# Altium schematic sheet full.SchDoc
size A4; SheetNumber: 1; SheetTotal: 2; SPICEModelCacheFOHOLSYI: <root> / <DocumentId>FOHOLSYI</DocumentId> / <CacheFrame Number="0"> / <Model Name="1n4002" Kind="MDL"> / <Text>*1N4002 MCE 8-16-95 / *100V 1A Si GenPurpose Diode pkg:DIODE0.4 1,2 / .MODEL 1N4002 D(IS=2.55E-9 RS=0.042 N=1.75 TT=5.76E-6 CJO=1.85E-11 / + VJ=0.75 M=0.333 BV=100 IBV=1E-5 )</Text> / </Model> / </CacheFrame> / </root>
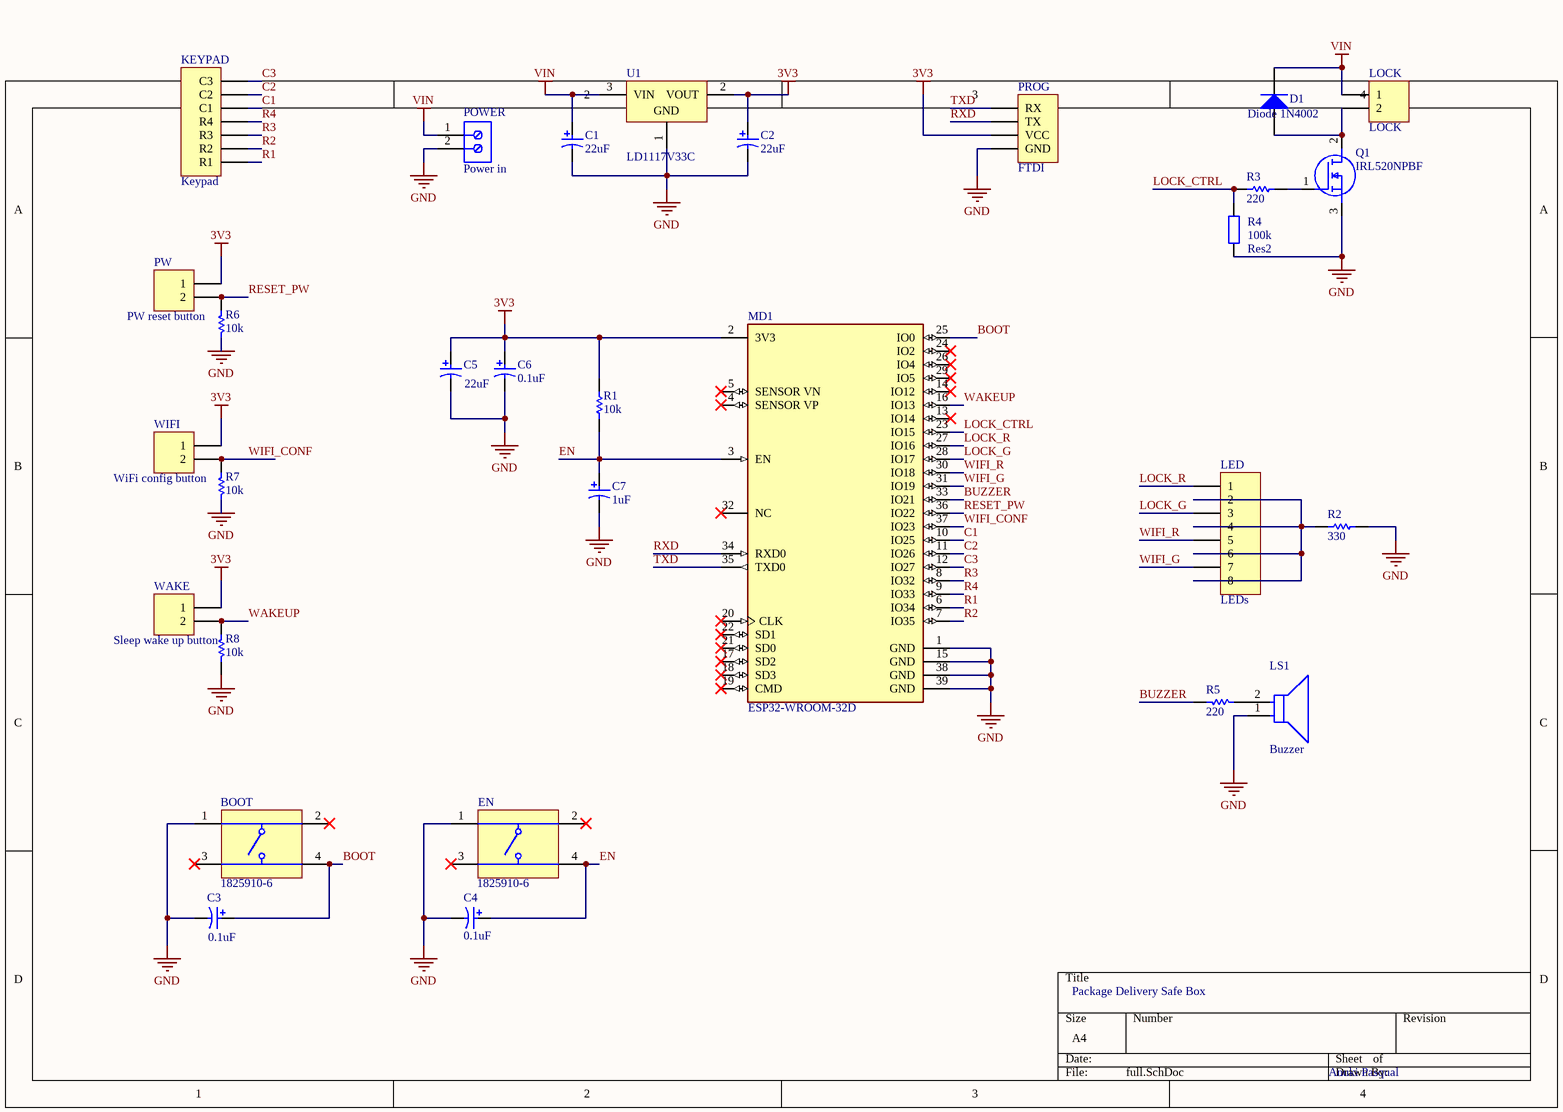
[diagram p0: full.SchDoc]

## Parts
BOOT  1825910-6  [TECO-1825910-6_V]
C1  22uF  [CAPPR55-200-1100X500X1200]
C2  22uF  [CAPPR55-200-1100X500X1200]
C3  0.1uF  [CAPPR55-200-1100X500X1200]
C4  0.1uF  [CAPPR55-200-1100X500X1200]
C5  22uF  [CAPPR55-200-1100X500X1200]
C6  0.1uF  [CAPPR55-200-1100X500X1200]
C7  1uF  [CAPPR55-200-1100X500X1200]
D1  Diode 1N4002  [DO-41]
EN  1825910-6  [TECO-1825910-6_V]
KEYPAD  Keypad  [HDR1X7]
LED  LEDs  [HDR1X8]
LOCK  LOCK  [HDR1X2]
LS1  Buzzer  [FP-MCKPX-G1203A-K4056-MFG]
MD1  ESP32-WROOM-32D  [FP-ESP32-WROOM-32D-MFG]
POWER  Power in  [691102710002]
PROG  FTDI  [HDR1X4]
PW  PW reset button  [HDR1X2]
Q1  IRL520NPBF  [TO254P469X1042X1967-3P]
R1  value 10k  [AXIAL-0.3]
R2  330  [AXIAL-0.3]
R3  value 220  [AXIAL-0.3]
R4  Res2  value 100k  [AXIAL-0.4]
R5  value 220  [AXIAL-0.3]
R6  value 10k  [AXIAL-0.3]
R7  value 10k  [AXIAL-0.3]
R8  value 10k  [AXIAL-0.3]
U1  LD1117V33C  [TO220]
WAKE  Sleep wake up button  [HDR1X2]
WIFI  WiFi config button  [HDR1X2]

## Nets
3V3: C2.1 C5.1 C6.1 MD1.2(3V3) PROG.3(VCC) PW.1 R1.2 U1.2(VOUT) WAKE.1 WIFI.1
GND: BOOT.1 C1.2 C2.2 C3.2 C4.2 C5.2 C6.2 C7.2 EN.1 LS1.1(C) MD1.1(GND) MD1.15(GND) MD1.38(GND) MD1.39(GND) POWER.2 PROG.4(GND) Q1.3(S) R2.2 R4.1 R6.2 R7.2 R8.2 U1.1(GND)
VIN: C1.1 D1.2(K) LOCK.1 POWER.1 U1.3(VIN)
BOOT: BOOT.4 C3.1 MD1.25(IO0)
BUZZER: MD1.33(IO21) R5.1
C1: KEYPAD.5(C1) MD1.10(IO25)
C2: KEYPAD.6(C2) MD1.11(IO26)
C3: KEYPAD.7(C3) MD1.12(IO27)
EN: C4.1 C7.1 EN.4 MD1.3(EN) R1.1
LOCK_CTRL: MD1.23(IO15) R3.2 R4.2
LOCK_G: LED.3 MD1.28(IO17)
LOCK_R: LED.1 MD1.27(IO16)
R1: KEYPAD.1(R1) MD1.6(IO34)
R2: KEYPAD.2(R2) MD1.7(IO35)
R3: KEYPAD.3(R3) MD1.8(IO32)
R4: KEYPAD.4(R4) MD1.9(IO33)
RESET_PW: MD1.36(IO22) PW.2 R6.1
RXD: MD1.34(RXD0) PROG.2(TX)
TXD: MD1.35(TXD0) PROG.1(RX)
WAKEUP: MD1.16(IO13) R8.1 WAKE.2
WIFI_CONF: MD1.37(IO23) R7.1 WIFI.2
WIFI_G: LED.7 MD1.31(IO19)
WIFI_R: LED.5 MD1.30(IO18)
NetD1_1: D1.1(A) LOCK.2 Q1.2(D)
NetLED_2: LED.2 LED.4 LED.6 LED.8 R2.1
NetLS1_2: LS1.2(A) R5.2
NetQ1_1: Q1.1(G) R3.1

Not connected (* = marked no-connect by the designer): BOOT 2* 3*; EN 2* 3*; MD1 4(SENSOR_VP)* 5(SENSOR_VN)* 13(IO14)* 14(IO12)* 17(SD2)* 18(SD3)* 19(CMD)* 20(CLK)* 21(SD0)* 22(SD1)* 24(IO2)* 26(IO4)* 29(IO5)* 32(NC)*

## Notes on the sheet
- Package Delivery Safe Box
- Anuki Pasqual

## Library data of the parts
BOOT EN = CMP-1684-00021-1: Tact Switch, SPST-NO, 0.05 A, -35 to 85 degC, 4-Pin THD, RoHS, Bulk; Manufacturer: TE Connectivity; Maximum Contact Resistance: 100mOhm; Mechanical Life: 100000Cycles; Bushing Type: Unthreaded; Switch Configuration: OFF(ON); Maximum DC Voltage Rating: 24V; Contact Rating @ Voltage: 0.05A@24VDC; Actuator Color: Black; Body Orientation: Straight; Function: MomentaryContact; Illumination: N/R; Actuator Style: RoundButton; Actuator Material: PolybutyleneTerephthalate; Dielectric Strength: 500VAC; Pole Throw Configuration: SPST; Actuator Length: 1.4mm; Product Weight: N/A; Contact Material: CopperAlloy; Housing Material: N/A; Terminal Type: PCPins; Minimum Insulation Resistance: 100MOhm; Package Description: 4-Pin Through Hole Device, Body 5.99 x 5.99 mm, Pitch 6.5 mm; Part No: 1825910-6; Package Reference: THD; Base Material: N/A; Manufacturer URL: http://www.te.com; Contact Plating: Silver; RoHS: Yes; Datasheet Version: Rev. C9; Electrical Life: 100000Cycles; Maximum AC Voltage Rating: N/A; Thread Size: N/R; Operating Temperature: -35to85C; Mounting: ThroughHole; Dimension: 5.99x5mm; Datasheet URL: http://www.te.com/commerce/DocumentDelivery/DDEController?Action=showdoc&DocId=Customer+Drawing%7F1825910%7FC9%7Fpdf%7FEnglish%7FENG_CD_1825910_C9.pdf%7F1825910-6; Family: 1825910; Seal Location: N/A; Seal Description: N/A; Packaging: N/A
C1 C2 C5 = CMP-1665-00036-2: Aluminum Electrolytic Capacitor, 22 uF, +/- 20%, 50 V, -40 to 85 degC, 2-Pin THD, RoHS, Bulk; Manufacturer: Panasonic; Ripple Current: 100mA; Life (Hours): 2000Hour; Voltage: 50V; Dissipation Factor: 0.12%; Leakage Current: 3uA; Lead/Base Style: Straight; Lead Diameter: 0.5mm; Max Operating Temperature: 85degC; Height: 11mm; Package Reference: CAPPR55-200-1100X500X1200; Radiation Hardening: No; RoHSCompliant: true; Termination: Radial; Case/Package: Radial; REACH SVHC: NoSVHC; Height - Seated (Max): 0.472inch; Min Operating Temperature: -40degC; Packaging: Bulk; Manufacturer URL: http://www.panasonic.com/; Length: 11mm; Tolerance: 20%; Voltage Rating: 50V; Voltage Rating (DC): 50V; Datasheet URL: https://industrial.panasonic.com/cdbs/www-data/pdf/RDF0000/ABA0000C1218.pdf; Lead Pitch: 2mm; Ripple Current (AC): 100mA; Package Description: 2-Pin Radial Lead, Dia 5 mm, Height 12 mm; Diameter: 5mm; Capacitance: 22uF; Datasheet Version: Rev. 05, 10/2016; Package Quantity: 200; Mount: ThroughHole
C3 C4 C6 C7 = CMP-1665-00036-2: Aluminum Electrolytic Capacitor, 22 uF, +/- 20%, 50 V, -40 to 85 degC, 2-Pin THD, RoHS, Bulk; Manufacturer: Panasonic; Ripple Current: 100mA; Life (Hours): 2000Hour; Voltage: 50V; Dissipation Factor: 0.12%; Leakage Current: 3uA; Lead/Base Style: Straight; Capacitance: 22uF; Lead Diameter: 0.5mm; Max Operating Temperature: 85degC; Height: 11mm; Package Reference: CAPPR55-200-1100X500X1200; Radiation Hardening: No; RoHSCompliant: true; Termination: Radial; Case/Package: Radial; REACH SVHC: NoSVHC; Height - Seated (Max): 0.472inch; Min Operating Temperature: -40degC; Packaging: Bulk; Manufacturer URL: http://www.panasonic.com/; Length: 11mm; Tolerance: 20%; Voltage Rating: 50V; Voltage Rating (DC): 50V; Datasheet URL: https://industrial.panasonic.com/cdbs/www-data/pdf/RDF0000/ABA0000C1218.pdf; Lead Pitch: 2mm; Ripple Current (AC): 100mA; Package Description: 2-Pin Radial Lead, Dia 5 mm, Height 12 mm; Diameter: 5mm; Datasheet Version: Rev. 05, 10/2016; Package Quantity: 200; Mount: ThroughHole
D1 = Diode 1N4002: 1 Amp General Purpose Rectifier; Published: 8-Jun-2000; LatestRevisionDate: 17-Jul-2002; LatestRevisionNote: Re-released for DXP Platform.; DatasheetVersion: 1998; PackageVersion: Aug-1999; PackageReference: DO-41; Publisher: Altium Limited; PackageDescription: Diode, Axial; Body 5.2 x 2.7 mm (LxDia. max), Lead Dia. 0.86 mm (max); Code_JEDEC: DO-204-AL; ComponentLink1Description: Manufacturer Link; ComponentLink1URL: http://www.fairchildsemi.com/; ComponentLink2Description: Datasheet; ComponentLink2URL: http://www.fairchildsemi.com/ds/1N%2F1N4001.pdf
KEYPAD = Header 7: Header, 7-Pin; LatestRevisionDate: 17-Jul-2002; LatestRevisionNote: Re-released for DXP Platform.; Publisher: Altium Limited
LED = Header 8: Header, 8-Pin; LatestRevisionDate: 17-Jul-2002; LatestRevisionNote: Re-released for DXP Platform.; Publisher: Altium Limited
LOCK PW WAKE WIFI = Header 2: Header, 2-Pin; LatestRevisionDate: 17-Jul-2002; LatestRevisionNote: Re-released for DXP Platform.; Publisher: Altium Limited
LS1 = CMP-12433-000001-1: MAGNETIC BUZZER AND TRANSDUCER - More Details; Manufacturer Part Number: MCKPX-G1203A-K4056; Manufacturer: Multicomp Pro; Operating Supply Voltage: 3V; Current: 30mA; Frequency: 2300Hz; Max Supply Voltage: 5V; Min Supply Voltage: 2V; Standoff Height: 0.5mm; ComponentLink2Description: Datasheet; ComponentLink2URL: http://www.farnell.com/datasheets/1498149.pdf?_ga=2.17855225.1157923166.1572356775-536200964.1569240579; Temperature Range High: +70°C; Device Class L2: Audio Products; Temperature Range Low: -20°C; Package: 0; Temperature: -20°C to +70°C; Category: Speak; Octopart: https://octopart.com/mckpx-g1203a-k4056-multicomp-12157154; RoHS: TRUE; Lead Free: Yes; Height: 9.5mm; Device Class L1: Electromechanical; Automotive: No; Device Class L3: Buzzers
MD1 = CMP-194065-000003-1: WIFI MODULE 32MBITS SPI FLASH; Manufacturer: Espressif Systems; Max Supply Voltage: 3.6V; Nominal Supply Current: 500mA; Max Frequency: 2484MHz; Number Of Adc Channels: 16; Number Of Gpio: 32; Interface: I2C,SPI,UART,Ethernet,I2S,Other; Data Rate: 150Mbits/s; Min Supply Voltage: 3V; Bandwidth: 72MHz; Sensitivity: -98dBm; Octopart: https://octopart.com/esp32-wroom-32d-espressif+systems-91040050; Package: ESP32-WROOM-32D; ComponentLink2URL: https://www.espressif.com/sites/default/files/documentation/esp32-wroom-32d_esp32-wroom-32u_datasheet_en.pdf; Lead Free: Yes; Category: UNK; Mouser Description: Wi-Fi/BT BLE Module ESP32-D0WD, SPI Flash, UART, P; Device Class L1: Integrated Circuits (ICs); RoHS: TRUE; Temperature Range Low: -40°C; ComponentLink2Description: Datasheet; Digikey Description: WIFI MODULE 32MBITS SPI FLASH; Height: 3.2mm; Temperature: -40°C to +85°C; Manufacturer Part Number: ESP32-WROOM-32D; Device Class L3: Transceivers; Device Class L2: RF Semiconductors and Devices; Temperature Range High: +85°C; Automotive: No
POWER = CMP-1502-03258-1: Series 102 - 5.00 mm Horizontal Entry Modular with Pressure Clamp WR-TBL, 2 pin; Manufacturer: Wurth Elektronik; Pin Number: 2; Pitch: 5.00mm; Manufacturer URL: http://www.we-online.de; Mounting Technology: THT; Publisher: WurthElektronik; Packaging: Box; Package Reference: 691102710002; Datasheet URL: http://katalog.we-online.de/em/datasheet/6911027100xx.pdf; Operating Temperature: -40to105degC; Part Number: 691102710002
PROG = Header 4: Header, 4-Pin; LatestRevisionDate: 17-Jul-2002; LatestRevisionNote: Re-released for DXP Platform.; Publisher: Altium Limited
Q1 = IRL520NPBF: MOSFET (N-Channel); Manufacturer_Name: Infineon; Datasheet Link: https://www.infineon.com/dgdl/irl520npbf.pdf?fileId=5546d462533600a40153565f9b62255b; Height: 4.69mm; Manufacturer_Part_Number: IRL520NPBF; Mouser Part Number: 942-IRL520NPBF; Mouser Price/Stock: https://www.mouser.co.uk/ProductDetail/Infineon-Technologies/IRL520NPBF?qs=9%252BKlkBgLFf3eZ5ppEpIaKQ%3D%3D; Arrow Part Number: IRL520NPBF; Arrow Price/Stock: https://www.arrow.com/en/products/irl520npbf/infineon-technologies-ag?region=nac
R1-R3 R5-R8 = Res1: Resistor; Published: 8-Jun-2000; LatestRevisionDate: 17-Jul-2002; LatestRevisionNote: Re-released for DXP Platform.; PackageReference: AXIAL-0.3; Publisher: Altium Limited; PackageDescription: Axial Device, Thru-Hole; 2 Leads; 0.3 in Pin Spacing
R4 = Res2: Resistor; Published: 8-Jun-2000; LatestRevisionDate: 17-Jul-2002; LatestRevisionNote: Re-released for DXP Platform.; PackageReference: AXIAL-0.4; Publisher: Altium Limited; PackageDescription: Axial Device, Thru-Hole; 2 Leads; 0.4 in Pin Spacing
U1 = CMP-0244-00471-1: Fixed Low Drop Positive Voltage Regulator, 3.3V, 3-Pin TO-220; ComponentLink1URL: http://www.st.com; ComponentLink1Description: Manufacturer URL; PackageDescription: TO, Thru-Hole, Vertical, Heatsink Mounted; 3 In-Line Leads; Pitch 2.54 mm; ComponentLink2URL: http://www.st.com/internet/com/TECHNICAL_RESOURCES/TECHNICAL_LITERATURE/DATASHEET/CD00000544.pdf; PackageVersion: ver3.0; ComponentLink2Description: Datasheet; ComponentLink3URL: http://www.st.com/internet/com/TECHNICAL_RESOURCES/TECHNICAL_LITERATURE/PACKAGE_INFORMATION/CD00004649.pdf; ComponentLink3Description: Package Specification; PackageReference: TO220; DatasheetVersion: 1/11/2011